# Altium project NTC_6_Shoulder.PrjPcb
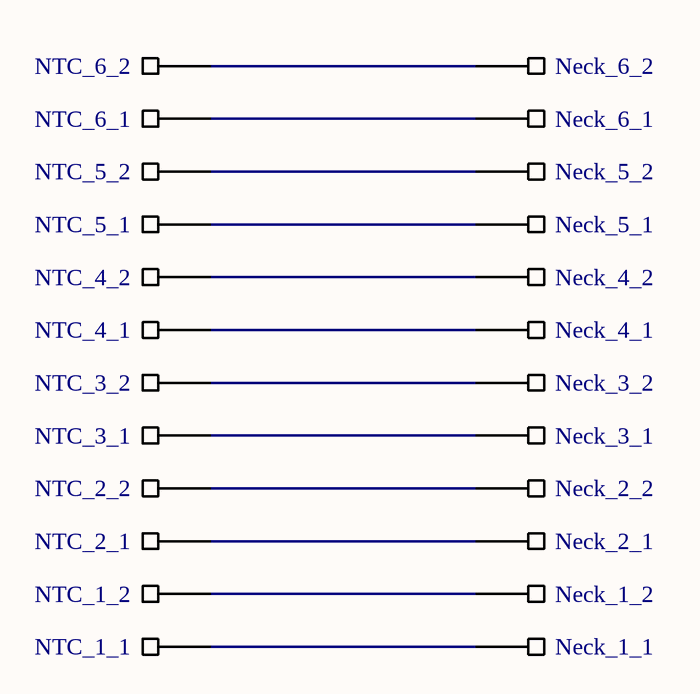
[diagram p0: NTC_6_Shoulder.SchDoc]
1 sheet, 24 parts. Net scope: global (net labels, ports and power ports of the same name join across sheets).
Board file: NTC_6_Shoulder.PcbDoc

## Sheet NTC_6_Shoulder.SchDoc
size A4; SheetNumber: 2; SheetTotal: 2

### Parts
Neck_1_1  Pad  [Generic_Pad_1.5x1.5]  (value not drawn)
Neck_1_2  Pad  [Generic_Pad_1.5x1.5]  (value not drawn)
Neck_2_1  Pad  [Generic_Pad_1.5x1.5]  (value not drawn)
Neck_2_2  Pad  [Generic_Pad_1.5x1.5]  (value not drawn)
Neck_3_1  Pad  [Generic_Pad_1.5x1.5]  (value not drawn)
Neck_3_2  Pad  [Generic_Pad_1.5x1.5]  (value not drawn)
Neck_4_1  Pad  [Generic_Pad_1.5x1.5]  (value not drawn)
Neck_4_2  Pad  [Generic_Pad_1.5x1.5]  (value not drawn)
Neck_5_1  Pad  [Generic_Pad_1.5x1.5]  (value not drawn)
Neck_5_2  Pad  [Generic_Pad_1.5x1.5]  (value not drawn)
Neck_6_1  Pad  [Generic_Pad_1.5x1.5]  (value not drawn)
Neck_6_2  Pad  [Generic_Pad_1.5x1.5]  (value not drawn)
NTC_1_1  Pad  [Generic_Pad_1.5x1.5]  (value not drawn)
NTC_1_2  Pad  [Generic_Pad_1.5x1.5]  (value not drawn)
NTC_2_1  Pad  [Generic_Pad_1.5x1.5]  (value not drawn)
NTC_2_2  Pad  [Generic_Pad_1.5x1.5]  (value not drawn)
NTC_3_1  Pad  [Generic_Pad_1.5x1.5]  (value not drawn)
NTC_3_2  Pad  [Generic_Pad_1.5x1.5]  (value not drawn)
NTC_4_1  Pad  [Generic_Pad_1.5x1.5]  (value not drawn)
NTC_4_2  Pad  [Generic_Pad_1.5x1.5]  (value not drawn)
NTC_5_1  Pad  [Generic_Pad_1.5x1.5]  (value not drawn)
NTC_5_2  Pad  [Generic_Pad_1.5x1.5]  (value not drawn)
NTC_6_1  Pad  [Generic_Pad_1.5x1.5]  (value not drawn)
NTC_6_2  Pad  [Generic_Pad_1.5x1.5]  (value not drawn)

### Nets
NetNeck_1_1_P: Neck_1_1.P(Pad) NTC_1_1.P(Pad)
NetNeck_1_2_P: Neck_1_2.P(Pad) NTC_1_2.P(Pad)
NetNeck_2_1_P: Neck_2_1.P(Pad) NTC_2_1.P(Pad)
NetNeck_2_2_P: Neck_2_2.P(Pad) NTC_2_2.P(Pad)
NetNeck_3_1_P: Neck_3_1.P(Pad) NTC_3_1.P(Pad)
NetNeck_3_2_P: Neck_3_2.P(Pad) NTC_3_2.P(Pad)
NetNeck_4_1_P: Neck_4_1.P(Pad) NTC_4_1.P(Pad)
NetNeck_4_2_P: Neck_4_2.P(Pad) NTC_4_2.P(Pad)
NetNeck_5_1_P: Neck_5_1.P(Pad) NTC_5_1.P(Pad)
NetNeck_5_2_P: Neck_5_2.P(Pad) NTC_5_2.P(Pad)
NetNeck_6_1_P: Neck_6_1.P(Pad) NTC_6_1.P(Pad)
NetNeck_6_2_P: Neck_6_2.P(Pad) NTC_6_2.P(Pad)

### Library data of the parts
Neck_1_1 Neck_1_2 Neck_2_1 Neck_2_2 Neck_3_1 Neck_3_2 Neck_4_1 Neck_4_2 Neck_5_1 Neck_5_2 Neck_6_1 Neck_6_2 NTC_1_1 NTC_1_2 NTC_2_1 NTC_2_2 NTC_3_1 NTC_3_2 NTC_4_1 NTC_4_2 NTC_5_1 NTC_5_2 NTC_6_1 NTC_6_2 = Generic_Pad_1.5x1.5: Pad 1.5mm x 1.5mm